# EAGLE design DMG Headphone (EAGLE 5.11)
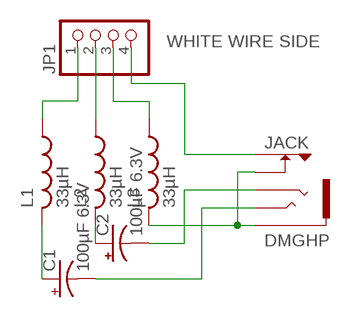
[diagram p0: schematic, sheet 1]

## Parts
C1  100µF 6.3V  CPOL-USE2.5-5  [E2,5-5]
C2  100µF 6.3V  CPOL-USE2.5-5  [E2,5-5]
JACK  DMGHP  [DMGHP]
JP1  PINHD-1X4  [1X04]
L1  33µH  L-US0204/7  [0204/7]
L2  33µH  L-US0204/7  [0204/7]
L3  33µH  L-US0204/7  [0204/7]

## Nets
N$1: JP1.1 L1.1
N$2: JP1.3 L3.1
N$3: JP1.2 L2.1
N$4: C1.+ L1.2
N$5: C2.+ L2.2
N$6: JACK.P$1(S) JACK.P$5(SWB) L3.2
N$7: JACK.P$4(SWA) JP1.4
N$8: C2.- JACK.P$3(R)
N$9: C1.- JACK.P$2(T)

## Notes on the sheet
- WHITE WIRE SIDE

## Library data of the parts
C1 C2 = rcl:CPOL-US: POLARIZED CAPACITOR, American symbol
JACK = Game Boy:DMGHP
JP1 = pinhead:PINHD-1X4: PIN HEADER
L1-L3 = rcl:L-US: INDUCTOR, American symbol

## Board
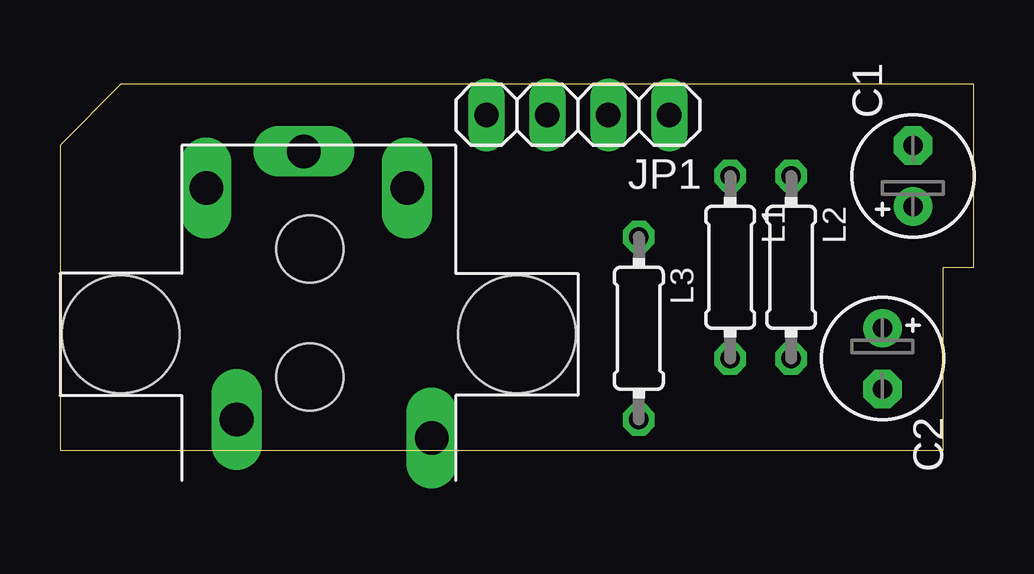
[diagram p1: board, top side]
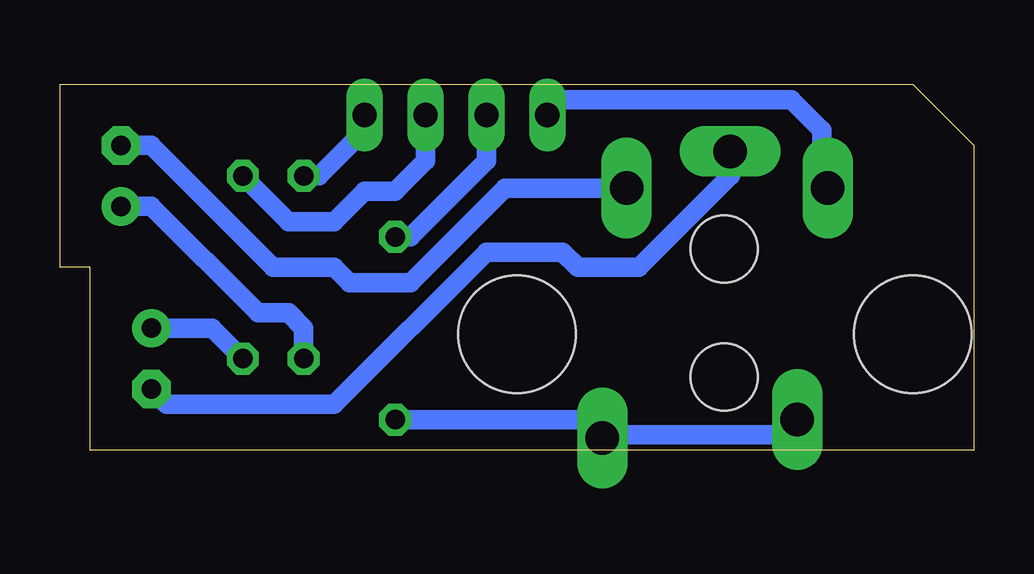
[diagram p2: board, bottom side, seen from below]

Size 38.1 x 15.24 mm. Coordinates in mm from the lower left corner, seen from the top.
Outline: 0,0 36.83,0 36.83,7.62 38.1,7.62 38.1,15.24 2.54,15.24 0,12.7 0,0
Copper layers (1*16): Top 0.035mm / dielectric 1.5mm / Bottom 0.035mm
Design rules "default": minimum track width 10mil, minimum drill 24mil, track to track 8mil, track to pad 8mil, pad to pad 8mil, via to via 8mil, smd to smd 8mil, copper to edge 40mil, drill to drill 8mil, minimum pad ring 10mil, minimum via ring 8mil, stop-mask expansion 4mil, vias tented up to drill 0mil, thermal gap 10mil

### Footprints (pad centres in the part's own frame; a part is rotated, then mirrored left to right if it is on the bottom)
E2,5-5 = drill 0.813 pad 1.6 round: + -1.27,0 | drill 0.813 pad 1.6 octagon: - 1.27,0
DMGHP = drill 1.4 long: P$1 4.064,-5.842; P$2 3.048,4.572; P$3 -1.27,6.096; P$4 -5.334,4.572; P$5 -4.064,-5.08 | hole 4.902: -8.89,-1.524; 7.62,-1.524 | hole 2.8: -1.016,2.032; -1.016,-3.302
1X04 = drill 1.016 long: 1 -3.81,0; 2 -1.27,0; 3 1.27,0; 4 3.81,0
0204/7 = drill 0.813 octagon: 1 -3.81,0; 2 3.81,0

### Placement (x,y rotation side)
C1  35.56,11.43 90 top
C2  34.29,3.81 270 top
JACK  11.43,6.35 0 top
JP1  21.59,13.97 180 top
L1  27.94,7.62 270 top
L2  30.48,7.62 270 top
L3  24.13,5.08 270 top

### Tracks (layer width: path | path; a pad name or v marks a point on that pad's centre or on a via)
N$1
  Bottom 0.813: JP1.1 25.4,13.34 27.3,11.43 L1.1
N$2
  Bottom 0.813: L3.1 23.5,8.89 20.32,12.06 JP1.3
N$3
  Bottom 0.813: JP1.2 22.86,12.06 24.13,10.79 25.4,10.79 26.67,9.53 28.57,9.53 L2.1
N$4
  Bottom 0.813: L1.2 27.94,5.08 28.57,5.71 29.84,5.71 34.29,10.16 C1.+
N$5
  Bottom 0.813: C2.+ 31.75,5.08 L2.2
N$6
  Bottom 0.813: L3.2 16.26,1.27 JACK.P$1 15.37,0.64 7.62,0.64 7.37,0.89 JACK.P$5
N$7
  Bottom 0.813: JACK.P$4 6.35,11.18 6.35,13.34 7.62,14.61 17.14,14.61 JP1.4
N$8
  Bottom 0.813: JACK.P$3 10.16,11.43 13.97,7.62 16.51,7.62 17.14,8.26 20.32,8.26 26.67,1.91 33.66,1.91 C2.-
N$9
  Bottom 0.813: JACK.P$2 19.56,10.92 23.5,6.99 26.04,6.99 26.67,7.62 29.21,7.62 34.29,12.7 C1.-